# Altium schematic sheet pwm-tl494.SchDoc
size A2 portrait; Organization: Protel International P/L; Address1: L3, 12a Rodborough Rd; Address2: Frenchs Forest; Address3: NSW; Address4: Australia 2086
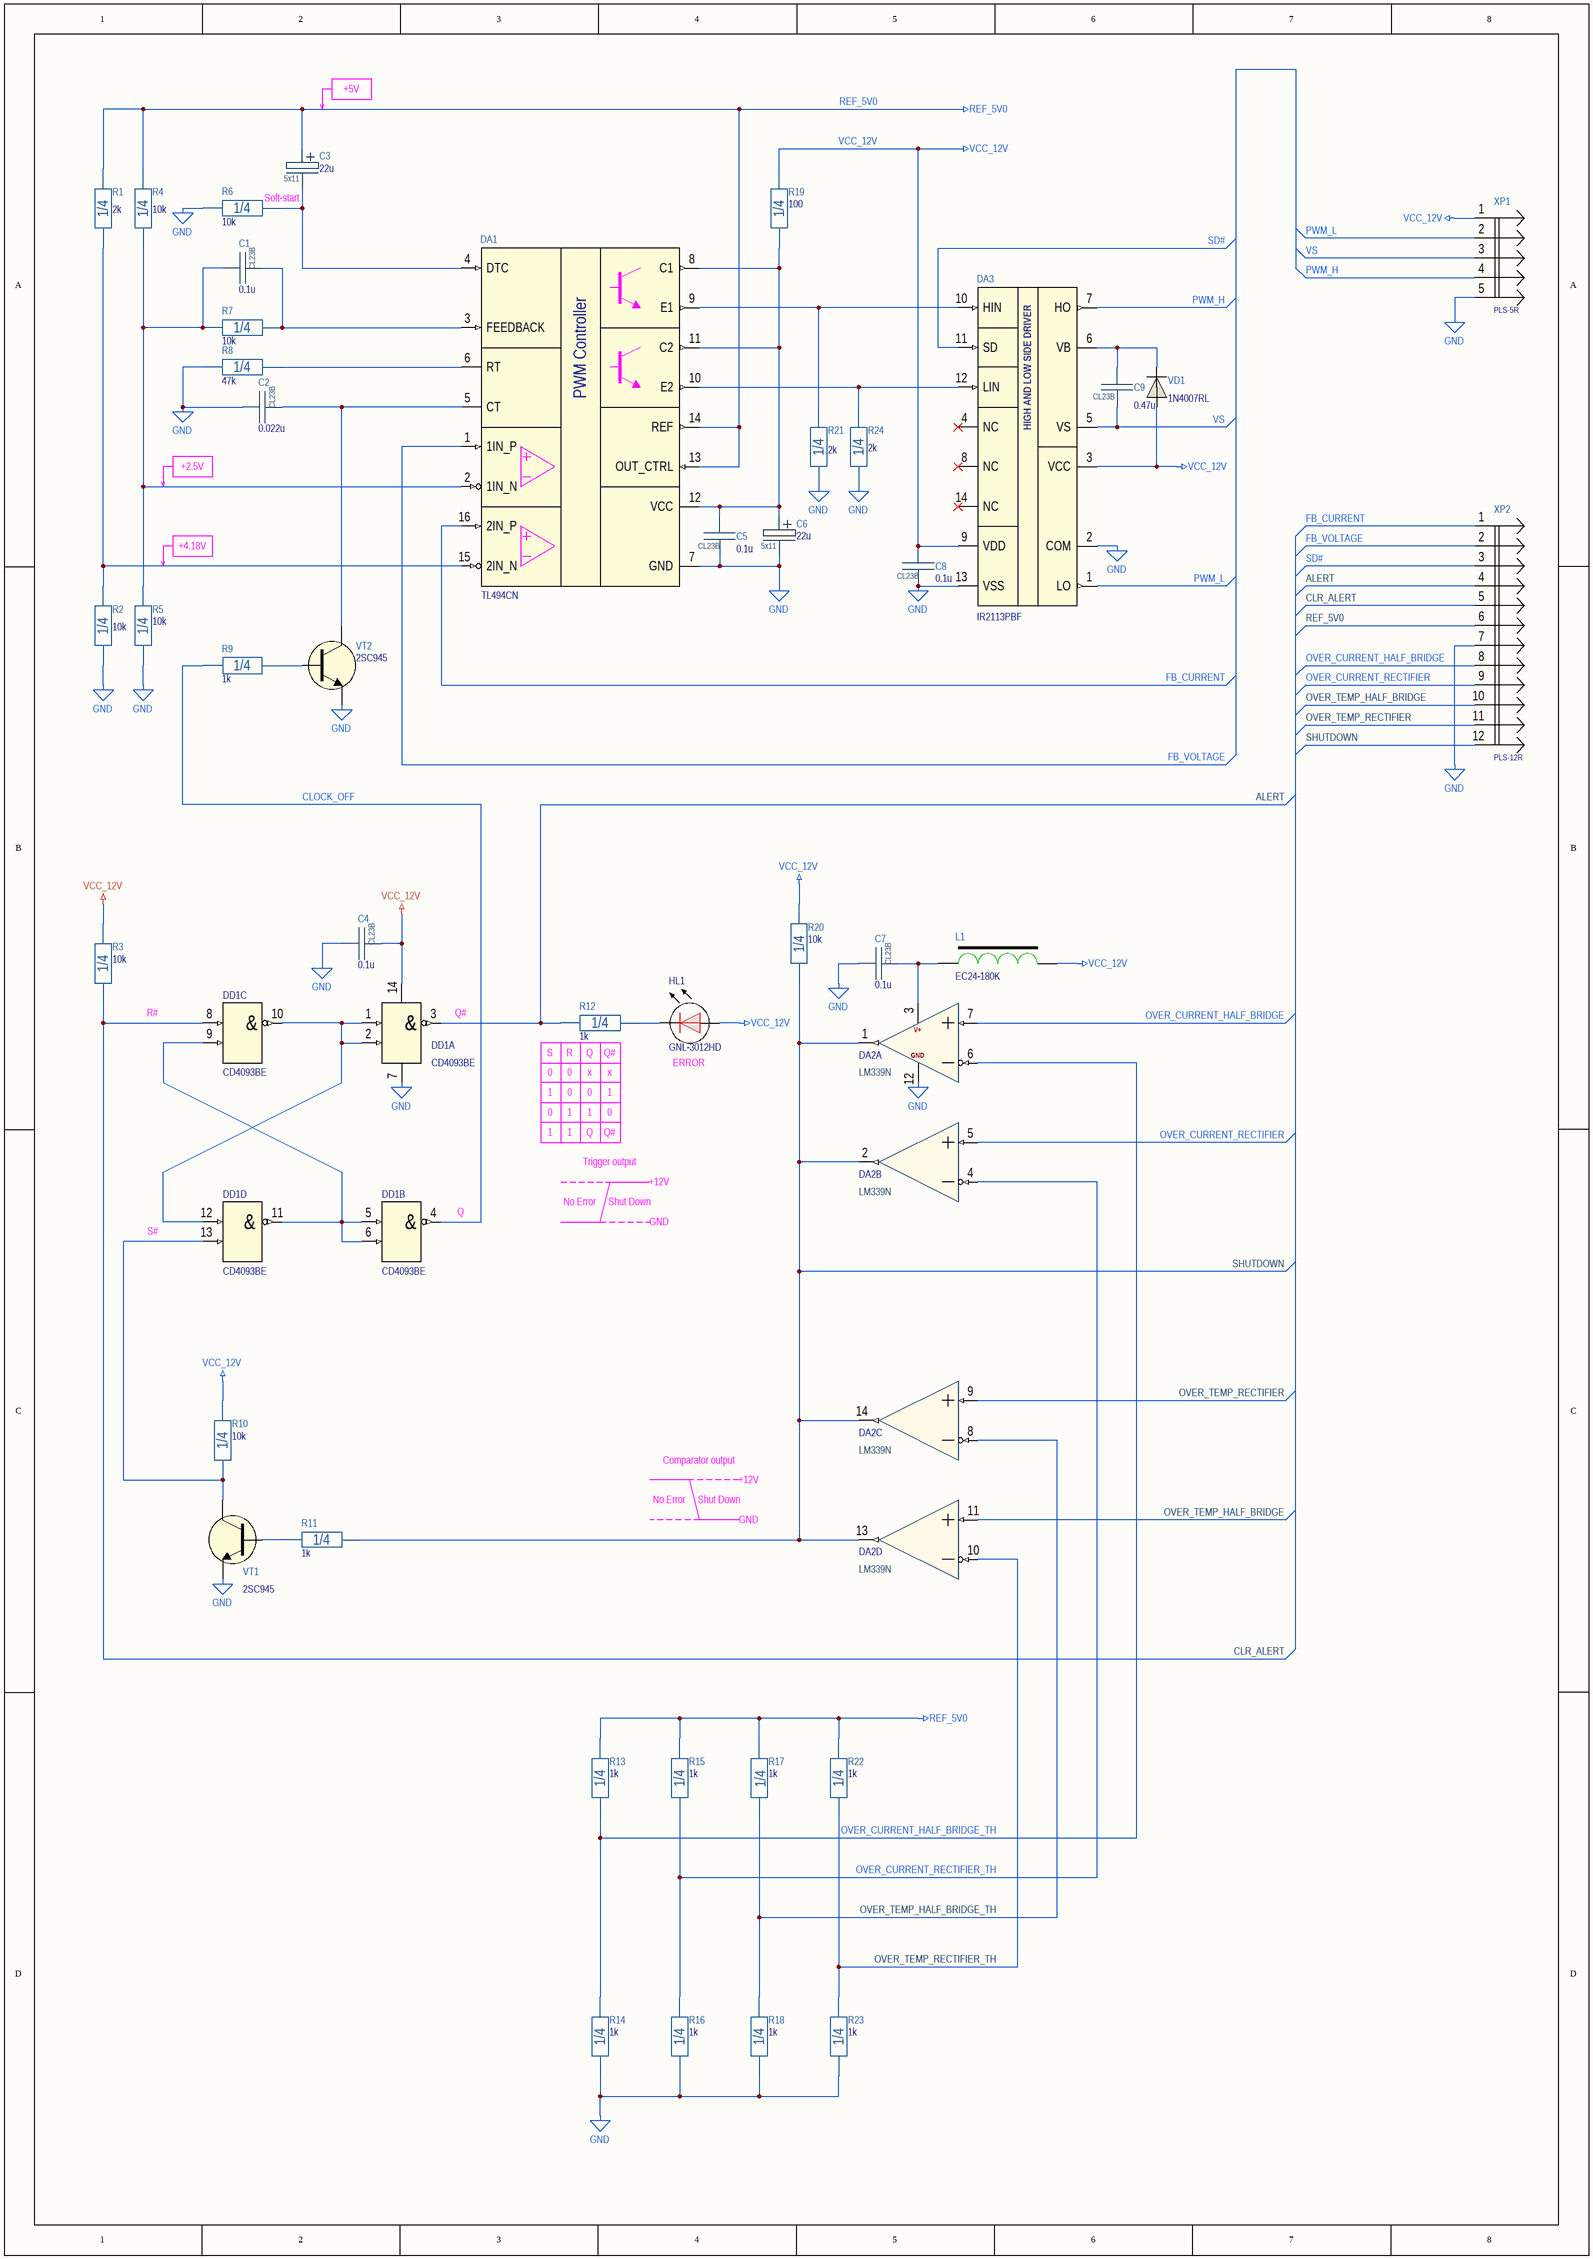
[diagram p0: pwm-tl494.SchDoc]

## Parts
C1  0.1u  [CL23B_7.2x2.5]
C2  0.022u  [CL23B_7.2x2.5]
C3  22u  Package: 5x11  [ECAP5X11X2.0_BRW]
C4  0.1u  [CL23B_7.2x2.5]
C5  0.1u  [CL23B_7.2x2.5]
C6  22u  Package: 5x11  [ECAP5X11X2.0_BRW]
C7  0.1u  [CL23B_7.2x2.5]
C8  0.1u  [CL23B_7.2x2.5]
C9  0.47u  [CL23B_7.2x3.5]
DA1  TL494CN  [DIP-16P-M03]
DA2  LM339N  [DIP-14P-M02]  (parts A,B,C,D of 4)
DA3  IR2113PBF  [DIP-14P-M02]
DD1  CD4093BE  [DIP-14P-M02]  (parts A,B,C,D of 4)
HL1  GNL-3012HD  [GNL-3012HD]
L1  EC24-180K  [EC24_GREEN_VERT]
R1  2k  Package: 1/4  [CFR-25(VERTICAL)]
R2  10k  Package: 1/4  [CFR-25(VERTICAL)]
R3  10k  Package: 1/4  [CFR-25]
R4  10k  Package: 1/4  [CFR-25(VERTICAL)]
R5  10k  Package: 1/4  [CFR-25(VERTICAL)]
R6  10k  Package: 1/4  [CFR-25(VERTICAL)]
R7  10k  Package: 1/4  [CFR-25(VERTICAL)]
R8  47k  Package: 1/4  [CFR-25(VERTICAL)]
R9  1k  Package: 1/4  [CFR-25(VERTICAL)]
R10  10k  Package: 1/4  [CFR-25]
R11  1k  Package: 1/4  [CFR-25(VERTICAL)]
R12  1k  Package: 1/4  [CFR-25(VERTICAL)]
R13  1k  Package: 1/4  [CFR-25(VERTICAL)]
R14  1k  Package: 1/4  [CFR-25(VERTICAL)]
R15  1k  Package: 1/4  [CFR-25(VERTICAL)]
R16  1k  Package: 1/4  [CFR-25(VERTICAL)]
R17  1k  Package: 1/4  [CFR-25(VERTICAL)]
R18  1k  Package: 1/4  [CFR-25(VERTICAL)]
R19  100  Package: 1/4  [CFR-25(VERTICAL)]
R20  10k  Package: 1/4  [CFR-25(VERTICAL)]
R21  2k  Package: 1/4  [CFR-25]
R22  1k  Package: 1/4  [CFR-25(VERTICAL)]
R23  1k  Package: 1/4  [CFR-25(VERTICAL)]
R24  2k  Package: 1/4  [CFR-25]
VD1  1N4007RL  [DO-41]
VT1  2SC945  [TO-92 (VERTICAL,LINE)]
VT2  2SC945  [TO-92 (VERTICAL,LINE)]
XP1  PLS-5R  [PLS-5R]
XP2  PLS-12R  [PLS-12R]

## Nets
GND: C2.2 C4.2 C5.1 C6.2 C7.2 C8.1 DA1.7(GND) DA2.12(GND) DA3.2(COM) DA3.13(VSS) DD1.7(GND) R2.2 R5.1 R6.1 R8.1 R14.1 R16.1 R18.2 R21.1 R23.1 R24.2 VT1.3(E) VT2.3(E) XP1.5 XP2.7
REF_5V0: C3.1 DA1.13(OUT_CTRL) DA1.14(REF) R1.1 R4.1 R13.1 R15.2 R17.1 R22.2 XP2.6
VCC_12V: C4.1 C8.2 DA3.3(VCC) DA3.9(VDD) DD1.14(VCC) HL1.2 L1.2 R3.2 R10.2 R19.2 R20.2 VD1.2(A) XP1.1
ALERT: DD1.3(Y0) R12.1 XP2.4
CLOCK_OFF: DD1.4(Y1) R9.1
CLR_ALERT: DD1.8(A2) R3.1 XP2.5
FB_CURRENT: DA1.16(2IN_P) XP2.1
FB_VOLTAGE: DA1.1(1IN_P) XP2.2
OVER_CURRENT_HALF_BRIDGE: DA2.7(1IN+) XP2.8
OVER_CURRENT_HALF_BRIDGE_TH: DA2.6(1IN-) R13.2 R14.2
OVER_CURRENT_RECTIFIER: DA2.5(2IN+) XP2.9
OVER_CURRENT_RECTIFIER_TH: DA2.4(2IN-) R15.1 R16.2
OVER_TEMP_HALF_BRIDGE: DA2.11(4IN+) XP2.10
OVER_TEMP_HALF_BRIDGE_TH: DA2.8(3IN-) R17.2 R18.1
OVER_TEMP_RECTIFIER: DA2.9(3IN+) XP2.11
OVER_TEMP_RECTIFIER_TH: DA2.10(4IN-) R22.1 R23.2
PWM_H: DA3.7(HO) XP1.4
PWM_L: DA3.1(LO) XP1.2
SD#: DA3.11(SD) XP2.3
SHUTDOWN: DA2.1(1OUT) DA2.2(2OUT) DA2.13(4OUT) DA2.14(3OUT) R11.1 R20.1 XP2.12
VS: C9.1 DA3.5(VS) XP1.3
NetC1_1: C1.1 DA1.3(FEEDBACK) R7.2
NetC1_2: C1.2 DA1.2(1IN_N) R4.2 R5.2 R7.1
NetC2_1: C2.1 DA1.5(CT) VT2.2(C)
NetC3_2: C3.2 DA1.4(DTC) R6.2
NetC5_2: C5.2 C6.1 DA1.8(C1) DA1.11(C2) DA1.12(VCC) R19.1
NetC7_1: C7.1 DA2.3(VCC) L1.1
NetC9_2: C9.2 DA3.6(VB) VD1.1(C)
NetDA1_6: DA1.6(RT) R8.2
NetDA1_9: DA1.9(E1) DA3.10(HIN) R21.2
NetDA1_10: DA1.10(E2) DA3.12(LIN) R24.1
NetDA1_15: DA1.15(2IN_N) R1.2 R2.1
NetDD1_1: DD1.1(A0) DD1.2(B0) DD1.10(Y2) DD1.12(A3)
NetDD1_5: DD1.5(A1) DD1.6(B1) DD1.9(B2) DD1.11(Y3)
NetDD1_13: DD1.13(B3) R10.1 VT1.2(C)
NetHL1_1: HL1.1 R12.2
NetR9_2: R9.2 VT2.1(B)
NetR11_2: R11.2 VT1.1(B)

Not connected (* = marked no-connect by the designer): DA3 4(NC)* 8(NC)* 14(NC)*

## Notes on the sheet
- +5V
- (near R6) Soft-start
- +2.5V
- +4.18V
- R#
- (near DD1) Q#
- (near R12) S
- (near R12) R
- (near R12) Q
- (near R12) Q#
- (near HL1) ERROR
- 0
- 1
- x
- Q
- Q#
- Trigger output
- (near DD1) Q
- No Error
- Shut Down
- +12V
- S#
- GND
- Comparator output
- Title
- Size:
- Date:
- A3
- Number:
- Time:
- Revision:
- Sheet
- of
- File:
- (in symbol CD4093BE, part A) &
- (in symbol CD4093BE, part B) &
- (in symbol CD4093BE, part C) &
- (in symbol CD4093BE, part D) &
- (in symbol LM339N, part A) V+
- (in symbol TL494CN) PWM Controller

## Library data of the parts
C1 C2 C4 C5 C7-C9 = CL23B: Box-type metallized polyester film capacitor; Tolerance: ± * %; Voltage: 63V; Dielectric: Polyester; Part Number: *; Manufacturer: *; Package: CL23B
  C1 C4 C5 C7 C8: Value: 0.1u; Value on schem: 0.1u
  C2: Value: 0.022u; Value on schem: 0.022u
  C9: Value: 0.47u; Value on schem: 0.47u
C3 C6 = C_ECAP: Aluminium capacitor; Part Number: UVR1J220MDD; Manufacturer: Nichicon; Tolerance: ± 20 %; Voltage: 63V; Value: 22u; Value on schem: 22u
DA1 = TL494CN: Pulse-Width-Modulation Control Circuits; Manufacturer: Texas Instruments; Part Number: TL494CN; Package: DIP-16
DA2 = LM339N: Quad Comparators; Manufacturer: Texas Instruments; Part Number: LM339N; Package: DIP-14
DA3 = IR2113PBF: HIGH AND LOW SIDE DRIVER; Manufacturer: International Rectifier; Part Number: IR2113PBF; Package: DIP-14
DD1 = CD4093BE: Quad 2-Input NAND Gate Schmitt Triggers; Manufacturer: Texas Instruments; Part Number: CD4093BE; Package: DIP-14
HL1 = GNL-3012HD: Standard Brightness 3mm LED; Manufacturer: G-Nor Optoelectronics; Color: Red, 700 nm; Package: 3mm; Part Number: GNL-3012HD
L1 = EC24: Axial leaded coated inductors; Manufacturer: 3L Electronic; RDC: 1 Ohm; SRF Min: 15 MHz; Q: 40; Irms  Max: 315 mA; Inductance @ 100 kHz: 18 µH; Part Number: EC24-180K; Package: EC24
R1 R21 R24 = CF25: Resistor 1/4W; Part Number: MFR-25FTF52-2K; Manufacturer: Yageo; Tolerance: ± 1 %; Voltage: 250V; Temperature Coefficient: ±100 ppm/°C; Value: 2k; Value on schem: 2k
R2-R7 R10 R20 = CF25: Resistor 1/4W; Part Number: MFR-25FTF52-10K; Manufacturer: Yageo; Tolerance: ± 1 %; Voltage: 250V; Temperature Coefficient: ±100 ppm/°C; Value: 10k; Value on schem: 10k
R8 = CF25: Resistor 1/4W; Part Number: MFR-25FTF52-47K; Manufacturer: Yageo; Tolerance: ± 1 %; Voltage: 250V; Temperature Coefficient: ±100 ppm/°C; Value: 47k; Value on schem: 47k
R9 R11-R18 R22 R23 = CF25: Resistor 1/4W; Part Number: MFR-25FTF52-1K; Manufacturer: Yageo; Tolerance: ± 1 %; Voltage: 250V; Temperature Coefficient: ±100 ppm/°C; Value: 1k; Value on schem: 1k
R19 = CF25: Resistor 1/4W; Part Number: MFR-25FTF52-100R; Manufacturer: Yageo; Tolerance: ± 1 %; Voltage: 250V; Temperature Coefficient: ±100 ppm/°C; Value: 100; Value on schem: 100
VD1 = 1N4007RL: 1A 1000V Standard Recovery Rectifiers Diode; Manufacturer: ON Semiconductor; Part Number: 1N4007RL; Package: DO-41
VT1 VT2 = 2SC945: General Purpose n-p-n Transistors; Manufacturer: NEC; Package: TO-92; Part Number: 2SC945
XP1 = PLS-5R: Value: PLS-5R
XP2 = PLS-12R: Value: PLS-12R